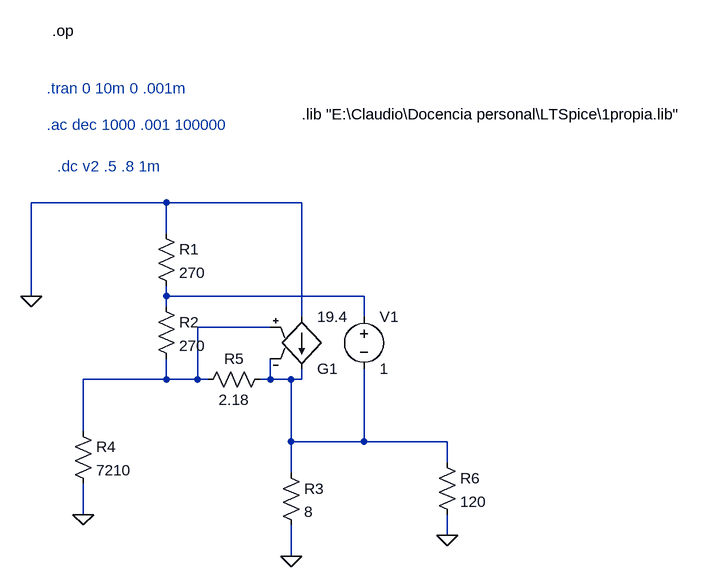
[diagram p0: schematic bootstrap2.asc]
bootstrap2.asc, the LTspice schematic file:
Version 4
SHEET 1 1140 680
WIRE 144 -32 -64 -32
WIRE 352 -32 144 -32
WIRE 144 16 144 -32
WIRE -64 112 -64 -32
WIRE 144 112 144 96
WIRE 448 112 144 112
WIRE 144 128 144 112
WIRE 352 144 352 -32
WIRE 448 144 448 112
WIRE 304 160 192 160
WIRE 144 240 144 208
WIRE 144 240 16 240
WIRE 192 240 192 160
WIRE 192 240 144 240
WIRE 208 240 192 240
WIRE 304 240 304 208
WIRE 304 240 288 240
WIRE 336 240 304 240
WIRE 352 240 352 224
WIRE 352 240 336 240
WIRE 16 320 16 240
WIRE 336 336 336 240
WIRE 448 336 448 224
WIRE 448 336 336 336
WIRE 576 336 448 336
WIRE 576 368 576 336
WIRE 336 384 336 336
WIRE 16 448 16 400
WIRE 576 480 576 448
WIRE 336 512 336 464
FLAG -64 112 0
FLAG 336 512 0
FLAG 16 448 0
FLAG 576 480 0
SYMBOL res 128 0 R0
SYMATTR InstName R1
SYMATTR Value 270
SYMBOL res 128 112 R0
SYMATTR InstName R2
SYMATTR Value 270
SYMBOL res 320 368 R0
SYMATTR InstName R3
SYMATTR Value 8
SYMBOL res 0 304 R0
SYMATTR InstName R4
SYMATTR Value 7210
SYMBOL voltage 448 128 R0
WINDOW 123 0 0 Left 0
WINDOW 39 0 0 Left 0
SYMATTR InstName V1
SYMATTR Value 1
SYMBOL res 304 224 R90
WINDOW 0 0 56 VBottom 2
WINDOW 3 32 56 VTop 2
SYMATTR InstName R5
SYMATTR Value 2.18
SYMBOL g2 352 240 M180
SYMATTR InstName G1
SYMATTR Value 19.4
SYMBOL res 560 352 R0
SYMATTR InstName R6
SYMATTR Value 120
TEXT -32 -296 Left 2 !.op
TEXT -40 -152 Left 2 ;.ac dec 1000 .001 100000
TEXT -24 -88 Left 2 ;.dc v2 .5 .8 1m
TEXT -40 -208 Left 2 ;.tran 0 10m 0 .001m
TEXT 352 -168 Left 2 !.lib "E:\\Claudio\\Docencia personal\\LTSpice\\1propia.lib"

The netlist it stands for:
* bootstrap2.asc
R1 0 N001 270
R2 N001 N002 270
R3 N003 0 8
R4 N002 0 7210
V1 N001 N003 1
R5 N003 N002 2.18
G1 0 N003 N002 N003 19.4
R6 N003 0 120
.op
* .ac dec 1000 .001 100000
* .dc v2 .5 .8 1m
* .tran 0 10m 0 .001m
.lib "E:\Claudio\Docencia personal\LTSpice\1propia.lib"
.backanno
.end